# EAGLE design Nico Microcontroller (EAGLE 9.2.1)
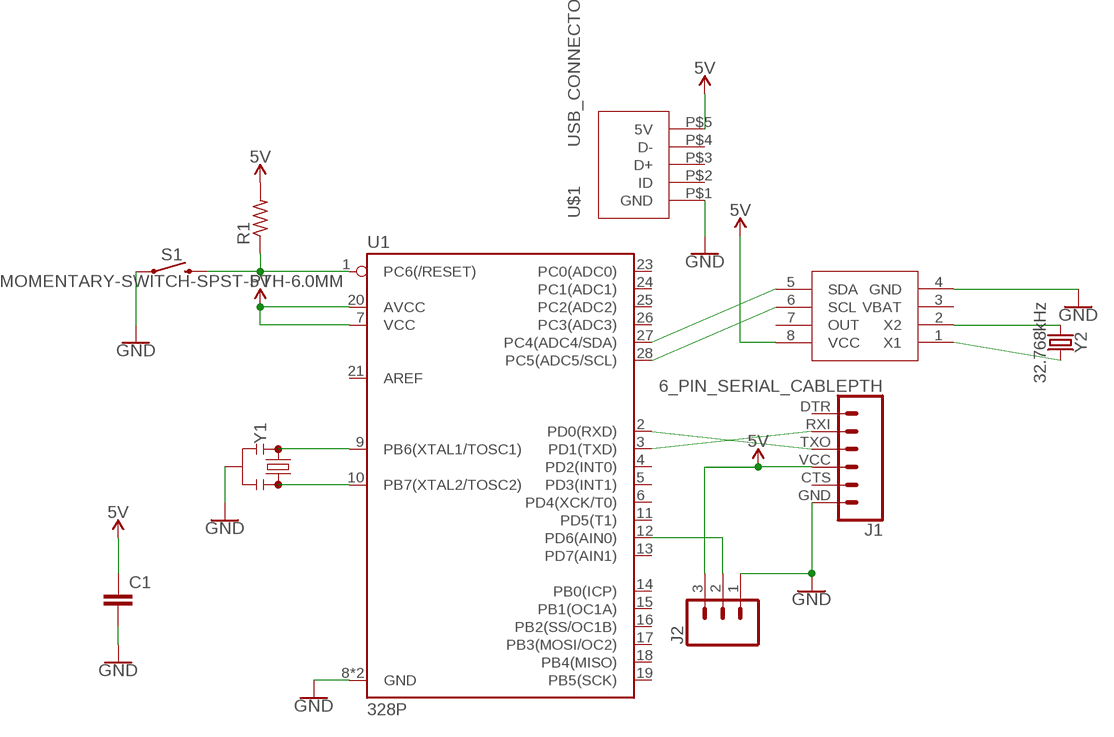
[diagram p0: schematic, sheet 1]

## Parts
C1  C2.5/2  [C2.5-2]
J1  6_PIN_SERIAL_CABLEPTH  [FTDI_BASIC]
J2  CONN_03  [1X03]
R1  R-US_0204/5  [0204/5]
S1  MOMENTARY-SWITCH-SPST-PTH-6.0MM  [TACTILE_SWITCH_PTH_6.0MM]
U1  328P  ATMEGA328P_PDIP  [DIP28]
U$1  USB_CONNECTOR  [USB-CONNECTOR]
U$2  DS1307  [DIP08]
Y1  RESONATORPTH-7.6X3.8  [RESONATOR-PTH-7.6X3.8]
Y2  32.768kHz  CRYSTAL-32.768KHZPTH-2X6  [CRYSTAL-PTH-2X6-CYL]

## Nets
5V: C1.1 J1.VCC J2.3 R1.2 U1.7(VCC) U1.20(AVCC) U$1.P$5(5V) U$2.8(VCC)
GND: C1.2 J1.GND J2.1 S1.1 U1.8(GND) U1.22(GND) U$1.P$1(GND) U$2.4(GND) Y1.2
N$1: R1.1 S1.3 U1.1(PC6(/RESET))
N$2: U1.9(PB6(XTAL1/TOSC1)) Y1.1
N$3: U1.10(PB7(XTAL2/TOSC2)) Y1.3
N$4: J1.RXI U1.3(PD1(TXD))
N$5: J2.2 U1.12(PD6(AIN0))
N$6: J1.TXO U1.2(PD0(RXD))
N$7: U1.27(PC4(ADC4/SDA)) U$2.5(SDA)
N$8: U1.28(PC5(ADC5/SCL)) U$2.6(SCL)
N$10: U$2.2(X2) Y2.1
N$11: U$2.1(X1) Y2.2
Unconnected: J1.CTS J1.DTR U1.4(PD2(INT0)) U1.5(PD3(INT1)) U1.6(PD4(XCK/T0)) U1.11(PD5(T1)) U1.13(PD7(AIN1)) U1.14(PB0(ICP)) U1.15(PB1(OC1A)) U1.16(PB2(SS/OC1B)) U1.17(PB3(MOSI/OC2)) U1.18(PB4(MISO)) U1.19(PB5(SCK)) U1.21(AREF) U1.23(PC0(ADC0)) U1.24(PC1(ADC1)) U1.25(PC2(ADC2)) U1.26(PC3(ADC3)) U$1.P$2(ID) U$1.P$3(D+) U$1.P$4(D-) U$2.3(VBAT) U$2.7(OUT)

## Library data of the parts
C1 = Nico's Library:C: CAPACITOR naming: grid - package width
J1 = Nico's Library:6_PIN_SERIAL_CABLE: 6-pin header connection for use with the "FTDI BASIC" pinout - CABLE SIDE. Also known as "Arduino Serial Program Header". This is used on a design to provide a 6-pin connection point for serial communication usually from a USB cable (D+/D-) to these headers (RX/TX). It also has the remaining pins necessary for programming in the Arduino evironment (DTR, GND, and sometimes VCC). Note, this device has "CABLE" in the name. It is intended to be used on a design that usually lives on the end of your USB cable and prvides the converter chip (FTDI232 or FTDI231x) to commnicate serial RX/TX. The "sister" device, named "TARGET" is inteneded to be used on a design that contains a target micro-controller that you wish to program. You can populate with some of these: Female Headers <https://www.sparkfun.com/products/115> (PRT-00115) For reference (or to suit your programming needs) check out these designs: SparkFun FTDI Basic Breakout - 5V <https://www.sparkfun.com/products/9716> (DEV-09716) SparkFun FTDI Basic Breakout - 3.3V <https://www.sparkfun.com/products/9873> (DEV-09873) SparkFun FTDI SmartBasic <https://www.sparkfun.com/products/12935> (DEV-12935) SparkFun Beefy 3 - FTDI Basic Breakout <https://www.sparkfun.com/products/13746> (DEV-13746)
J2 = Nico's Library:CONN_03: Multi connection point. Often used as Generic Header-pin footprint for 0.1 inch spaced/style header connections On any of the 0.1 inch spaced packages, you can populate with these: Break Away Headers - Straight <https://www.sparkfun.com/products/116> (PRT-00116) Break Away Male Headers - Right Angle <https://www.sparkfun.com/products/553> (PRT-00553) Female Headers <https://www.sparkfun.com/products/115> (PRT-00115) Break Away Headers - Machine Pin <https://www.sparkfun.com/products/117> (PRT-00117) Break Away Female Headers - Swiss Machine Pin <https://www.sparkfun.com/products/743> (PRT-00743) Stackable Header - 3 Pin (Female, 0.1") <https://www.sparkfun.com/products/13875> (PRT-13875) For SCREWTERMINALS and SPRING TERMINALS visit here: Screw Terimnals on SparkFun.com <https://www.sparkfun.com/search/results?term=Screw+Terminals> (5mm/3.5mm/2.54mm spacing) This device is also useful as a general connection point to wire up your design to another part of your project. Our various solder wires solder well into these plated through hole pads. Hook-Up Wire - Assortment (Stranded, 22 AWG) <https://www.sparkfun.com/products/11375> (PRT-11375) Hook-Up Wire - Assortment (Solid Core, 22 AWG) <https://www.sparkfun.com/products/11367> (PRT-11367) View the entire wire category on our website here <https://www.sparkfun.com/categories/141> Special notes: Molex polarized connector foot print use with SKU : PRT-08232 with associated crimp pins and housings.
R1 = Nico's Library:R-US_: RESISTOR, American symbol
S1 = Nico's Library:MOMENTARY-SWITCH-SPST: Momentary Switch (Pushbutton) - SPST Normally-open (NO) SPST momentary switches (buttons, pushbuttons). Variants PTH-12MM - 12mm square, through-hole Momentary Pushbutton Switch - 12mm Square <https://www.sparkfun.com/products/9190> (COM-09190) PTH-6.0MM, PTH-6.0MM-KIT - 6.0mm square, through-hole Mini Pushbutton Switch <https://www.sparkfun.com/products/97> (COM-00097) KIT package intended for soldering kit's - only one side of pads' copper is exposed. PTH-RIGHT-ANGLE-KIT - Right-angle, through-hole Right Angle Tactile Button <https://www.sparkfun.com/products/10791> - Used on SparkFun BigTime Watch Kit <https://www.sparkfun.com/products/11734> SMD-12MM - 12mm square, surface-mount Tactile Button - SMD (12mm) <https://www.sparkfun.com/products/12993> (COM-12993) Used on SparkFun PicoBoard <https://www.sparkfun.com/products/11888> SMD-4.5MM - 4.5mm Square Trackball Switch Used on SparkFun Blackberry Trackballer Breakout <https://www.sparkfun.com/products/13169> SMD-4.6MMX2.8MM - 4.60mm x 2.80mm, surface mount Used on SparkFun SAMD21 Mini Breakout <https://www.sparkfun.com/products/13664> SMD-5.2MM, SMD-5.2-REDUNDANT - 5.2mm square, surface-mount Mini Pushbutton Switch - SMD <https://www.sparkfun.com/products/8720> (COM-08720) Used on Arduino Pro Mini <https://www.sparkfun.com/products/11114> REDUNDANT package connects both switch circuits together SMD-6.0X3.5MM - 6.0 x 3.5mm, surface mount Momentary Reset Switch SMD <https://www.sparkfun.com/products/8229> (COM-08229) SMD-6.2MM-TALL - 6.2mm square, surface mount Tactile Button - SMD (6mm) <https://www.sparkfun.com/products/12992> Used on SparkFun Digital Sandbox <https://www.sparkfun.com/products/12651> SMD-RIGHT-ANGLE - Right-angle, surface mount Used on SparkFun Block for Intel® Edison - Arduino <https://www.sparkfun.com/products/13036>; PROD_ID: SWCH-08441; SF_SKU: COM-00097
U1 = Nico's Library:ATMEGA328P_PDIP: Atmel 328P Through hole ATMEGA328P uC used in the Arduino 32kb flash, 1k EEPROM, 2k SRAM Datasheet <http://www.sparkfun.com/datasheets/Components/SMD/ATMega328.pdf> SparkFun Products Storefront component: AVR 28 Pin 20MHz 32K 6A/D - ATMega328P <https://www.sparkfun.com/products/9061> (COM-09061) SparkFun Simon Says - Through-Hole Soldering Kit <https://www.sparkfun.com/products/10547> (KIT-10547) SparkFun Learn to Solder - Simon Says <https://www.sparkfun.com/products/13708> (KIT-13708) SparkFun BigTime Watch Kit <https://www.sparkfun.com/products/11734> (KIT-11734) SparkFun ClockIt <https://www.sparkfun.com/products/10930> (KIT-10930) SparkFun Serial Enabled LCD Kit <https://www.sparkfun.com/products/10097> (LCD-10097) SparkFun Simon Tilts - Through Hole Soldering Kit <https://www.sparkfun.com/products/12634> (KIT-12634) SparkFun Frequency Counter Kit <https://www.sparkfun.com/products/10140> (KIT-10140) FabFM Radio Kit <https://www.sparkfun.com/products/11043> (KIT-11043) SparkFun Binary Blaster Kit <https://www.sparkfun.com/products/12037> (KIT-12037) SparkFun Metro-Gnome <https://www.sparkfun.com/products/9236> (KIT-09236) ATmega328 with Arduino Optiboot (Uno) <https://www.sparkfun.com/products/10524> (DEV-10524); PROD_ID: IC-09136
U$1 = Nico's Library:USB_CONNECTOR
U$2 = Nico's Library:DS1307
Y1 = Nico's Library:RESONATOR: Resonators (Generic) Ceramic resonators are clock-generating components, often used to control timing in microcontrollers. They usually have 3 pins: two pins for oscillation, and one pin for ground. Compared to crystals, resonators have worse tolerance, but are usually much cheaper. Plus, they have built-in load capacitors! These devices are used on boards like the Arduino Pro 8MHz <https://www.sparkfun.com/products/11114> and Arduino Pro 16MHz <https://www.sparkfun.com/products/11113>.
Y2 = Nico's Library:CRYSTAL-32.768KHZ: 32.768kHz Crystal Frequency: 32.768kHz Frequency Stability: ±20ppm Load Capacitance: 12.5pF (PTH-2X6 & SMD-3.2X1.5), 6pF (SMD-2X6) SparkFun Products: SparkFun BigTime Watch Kit <https://www.sparkfun.com/products/11734> SparkFun nRF52832 Breakout <https://www.sparkfun.com/products/13990> SparkFun Real Time Clock Module <https://www.sparkfun.com/products/12708>; PROD_ID: XTAL-10112

## Net classes
0 default: width 0.457 mm, drill 0.457 mm, clearance 0.457 mm

## Board
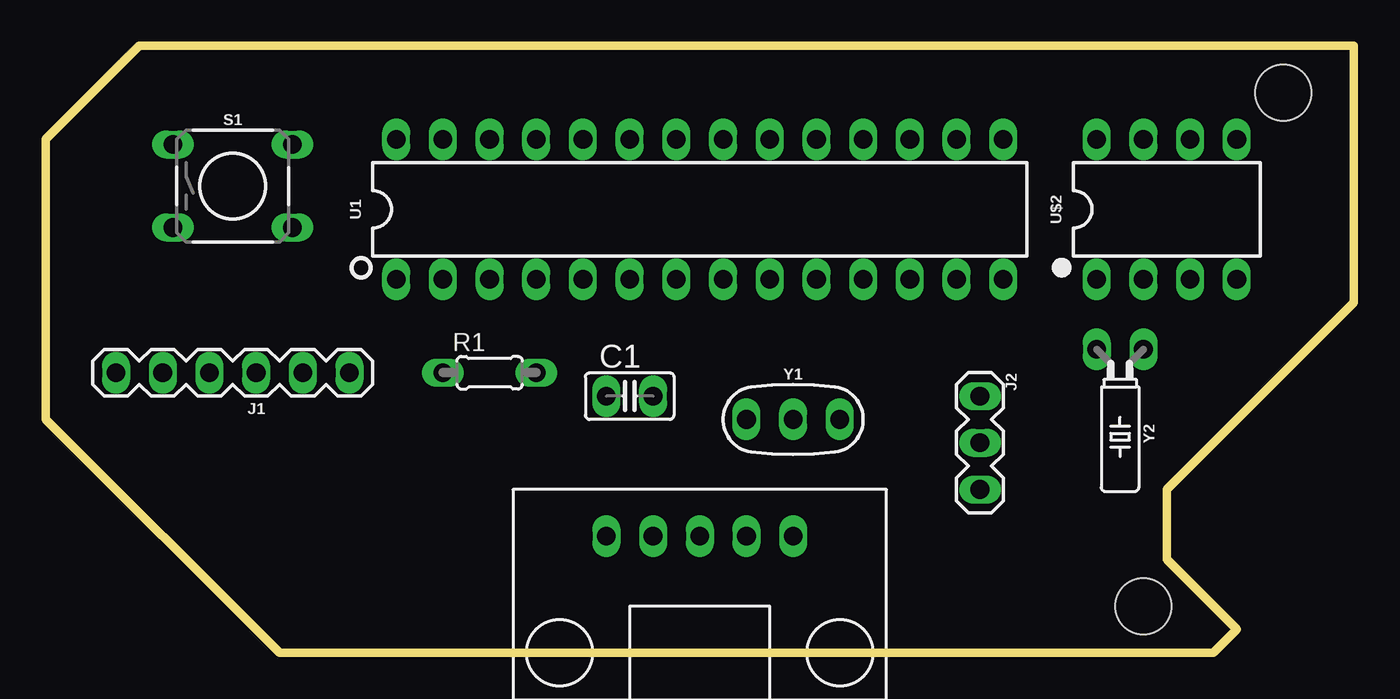
[diagram p1: board, top side]
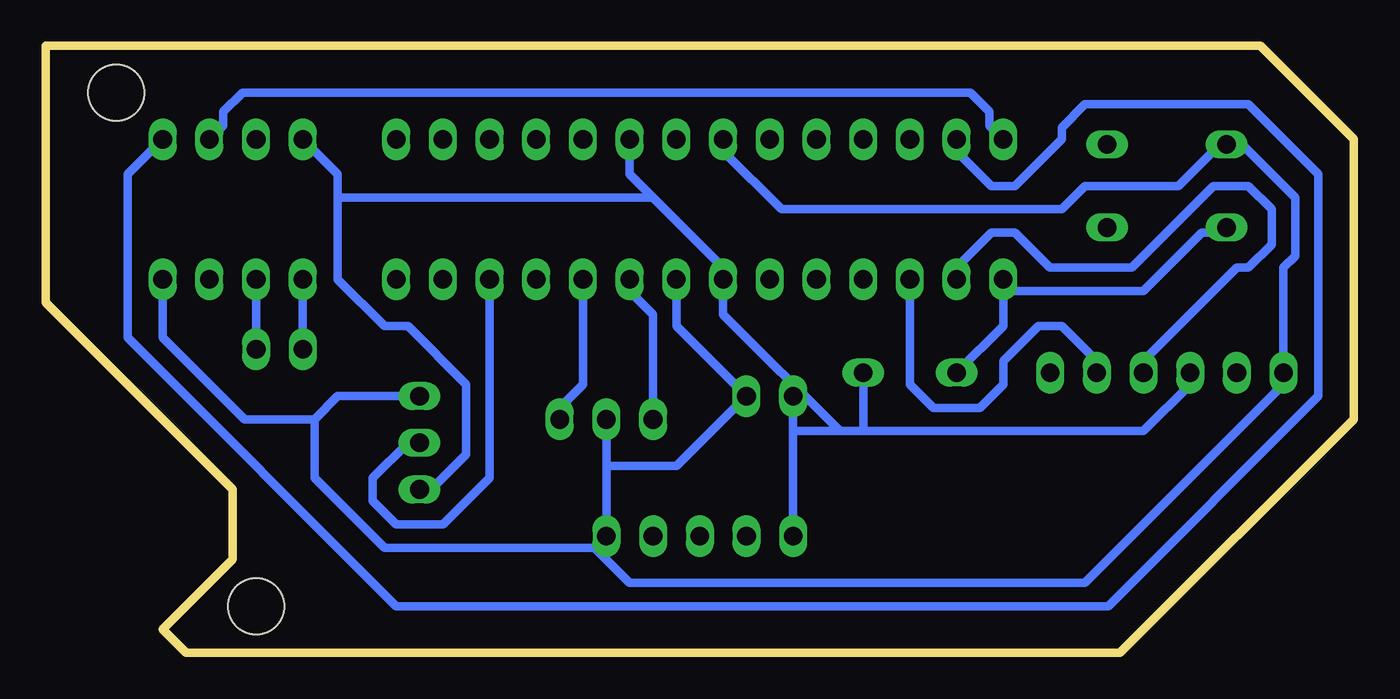
[diagram p2: board, bottom side, seen from below]

Size 71.12 x 33.02 mm. Coordinates in mm from the lower left corner, seen from the top.
Outline: 71.12,33.02 5.08,33.02 0,27.94 0,12.7 12.7,0 63.5,0 64.77,1.27 60.96,5.08 60.96,8.89 71.12,19.05 71.12,33.02
Copper layers (1*16): Top 0.035mm / dielectric 1.5mm / Bottom 0.035mm
Design rules "OthermillDRC_1_32_v2": minimum track width 8mil, minimum drill 0.8mm, track to track 0.794003125mm, track to pad 0.794003125mm, pad to pad 0.794003125mm, via to via 0.794003125mm, smd to smd 0mil, copper to edge 0mil, drill to drill 1mil, minimum pad ring 10mil, minimum via ring 10mil, stop-mask expansion 1mil, vias tented up to drill 30mil, thermal gap 10mil
Holes 3.05 mm at 59.69,2.54 67.31,30.48

### Footprints (pad centres in the part's own frame; a part is rotated, then mirrored left to right if it is on the bottom)
C2.5-2 = drill 1.016 long: 1 -1.27,0; 2 1.27,0
FTDI_BASIC = drill 1.016 long: CTS 10.16,0; DTR 0,0; GND 12.7,0; RXI 2.54,0; TXO 5.08,0; VCC 7.62,0
1X03 = drill 1.016 long: 1 0,0; 2 2.54,0; 3 5.08,0
0204/5 = drill 1.016 long: 1 -2.54,0; 2 2.54,0
TACTILE_SWITCH_PTH_6.0MM = drill 1.016 long: 1 -3.251,2.261; 2 3.251,2.261; 3 -3.251,-2.261; 4 3.251,-2.261
DIP28 = drill 1.016 long: 1 -16.51,-3.81; 2 -13.97,-3.81; 3 -11.43,-3.81; 4 -8.89,-3.81; 5 -6.35,-3.81; 6 -3.81,-3.81; 7 -1.27,-3.81; 8 1.27,-3.81; 9 3.81,-3.81; 10 6.35,-3.81; 11 8.89,-3.81; 12 11.43,-3.81; 13 13.97,-3.81; 14 16.51,-3.81; 15 16.51,3.81; 16 13.97,3.81; 17 11.43,3.81; 18 8.89,3.81; 19 6.35,3.81; 20 3.81,3.81; 21 1.27,3.81; 22 -1.27,3.81; 23 -3.81,3.81; 24 -6.35,3.81; 25 -8.89,3.81; 26 -11.43,3.81; 27 -13.97,3.81; 28 -16.51,3.81
USB-CONNECTOR = drill 1.016 long: P$1 -5.08,0; P$2 -2.54,0; P$3 0,0; P$4 2.54,0; P$5 5.08,0
DIP08 = drill 1.016 long: 1 -3.81,-3.81; 2 -1.27,-3.81; 3 1.27,-3.81; 4 3.81,-3.81; 5 3.81,3.81; 6 1.27,3.81; 7 -1.27,3.81; 8 -3.81,3.81
RESONATOR-PTH-7.6X3.8 = drill 1.016 long: 1 -2.54,0; 2 0,0; 3 2.54,0
CRYSTAL-PTH-2X6-CYL = drill 1.016 long: 1 -1.27,0; 2 1.27,0

### Placement (x,y rotation side)
C1  31.75,13.97 0 top
J1  16.51,15.24 180 top
J2  50.8,13.97 270 top
R1  24.13,15.24 0 top
S1  10.16,25.4 0 top
U1  35.56,24.13 0 top
U$1  35.56,6.35 180 top
U$2  60.96,24.13 0 top
Y1  40.64,12.7 0 top
Y2  58.42,16.51 180 top

### Tracks (layer width: path | path; a pad name or v marks a point on that pad's centre or on a via)
5V
  Bottom 0.457: J2.3 50.16,8.89 48.26,10.79 48.26,14.61 51.44,17.78 52.7,17.78 55.24,20.32 55.24,24.77 | 55.24,24.77 55.24,26.04 U$2.8 | C1.1 30.48,12.07 | 30.48,12.07 U$1.P$5 | J1.VCC 8.89,14.61 11.43,12.07 26.67,12.07 | 30.48,12.07 27.94,12.07 | 27.94,12.07 26.67,12.07 | 26.67,12.07 R1.2 | 27.94,12.07 34.29,18.41 U1.7 34.29,20.96 38.1,24.77 | U1.20 39.37,26.04 38.1,24.77 | 38.1,24.77 55.24,24.77
GND
  Bottom 0.457: U1.22 34.29,27.3 31.11,24.13 15.88,24.13 14.61,25.4 9.53,25.4 6.99,27.94 S1.1 6.35,27.94 3.17,24.77 3.17,21.59 3.81,20.96 J1.GND 3.81,14.61 14.61,3.81 39.37,3.81 41.27,5.71 | J2.1 55.24,13.97 56.52,12.7 | 56.52,12.7 60.33,12.7 64.77,17.14 U$2.4 | Y1.2 40.64,10.16 | 40.64,10.16 U$1.P$1 41.27,5.71 | 40.64,10.16 36.83,10.16 C1.2 36.83,17.78 U1.8 | 56.52,12.7 56.52,9.53 52.7,5.71 41.27,5.71
N$1
  Bottom 0.457: 19.05,19.68 19.05,17.78 R1.1 | 19.05,19.68 11.43,19.68 8.26,22.86 6.99,22.86 S1.3 | 19.05,19.68 U1.1
N$2
  Bottom 0.457: Y1.1 38.1,18.41 39.37,19.68 U1.9
N$3
  Bottom 0.457: U1.10 41.91,14.61 43.18,13.34 Y1.3
N$4
  Bottom 0.457: J1.RXI 13.97,15.88 15.88,17.78 17.14,17.78 19.05,15.88 19.05,14.61 20.32,13.34 22.86,13.34 24.13,14.61 U1.3
N$5
  Bottom 0.457: J2.2 51.44,11.43 53.34,9.53 53.34,8.26 52.07,6.99 49.53,6.99 46.99,9.53 U1.12
N$6
  Bottom 0.457: J1.TXO 11.43,15.88 6.35,20.96 5.71,20.96 4.45,22.23 4.45,24.13 5.71,25.4 7.62,25.4 12.06,20.96 16.51,20.96 18.41,22.86 19.68,22.86 21.59,20.96 U1.2
N$7
  Bottom 0.457: U1.27 21.59,27.3 19.68,25.4 18.41,25.4 15.88,27.94 15.88,28.57 14.61,29.84 5.71,29.84 1.91,26.04 1.91,13.97 13.34,2.54 52.07,2.54 66.67,17.14 66.67,26.04 U$2.5
N$8
  Bottom 0.457: U1.28 19.8,28.7 19.8,29.44 20.85,30.49 60.43,30.49 61.48,29.44 61.48,28.7 U$2.6
N$10
  Bottom 0.457: U$2.2 Y2.1
N$11
  Bottom 0.457: U$2.1 Y2.2